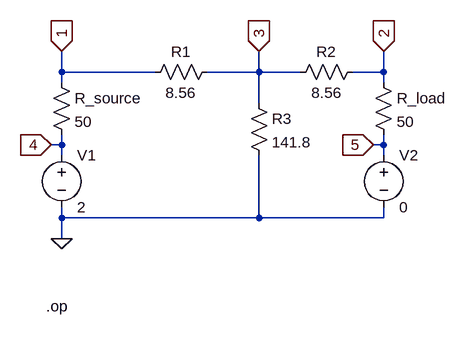
[diagram p0: schematic Two port circuit7.asc]
Two port circuit7.asc, the LTspice schematic file:
Version 4
SHEET 1 880 680
WIRE -304 -128 -304 -160
WIRE -160 -128 -304 -128
WIRE 0 -128 0 -160
WIRE 0 -128 -80 -128
WIRE 64 -128 0 -128
WIRE 192 -128 192 -160
WIRE 192 -128 144 -128
WIRE -304 -112 -304 -128
WIRE 192 -112 192 -128
WIRE 0 -80 0 -128
WIRE -304 -16 -304 -32
WIRE -304 -16 -320 -16
WIRE 192 -16 192 -32
WIRE 192 -16 176 -16
WIRE -304 0 -304 -16
WIRE 192 0 192 -16
WIRE -304 96 -304 80
WIRE 0 96 0 0
WIRE 0 96 -304 96
WIRE 192 96 192 80
WIRE 192 96 0 96
WIRE -304 128 -304 96
FLAG -304 128 0
FLAG 0 -160 3
IOPIN 0 -160 In
FLAG -304 -160 1
IOPIN -304 -160 In
FLAG 192 -160 2
IOPIN 192 -160 In
FLAG -320 -16 4
IOPIN -320 -16 In
FLAG 176 -16 5
IOPIN 176 -16 In
SYMBOL voltage -304 -16 R0
WINDOW 123 0 0 Left 2
WINDOW 39 0 0 Left 2
SYMATTR InstName V1
SYMATTR Value 2
SYMBOL res -176 -112 R270
WINDOW 0 32 56 VTop 2
WINDOW 3 0 56 VBottom 2
SYMATTR InstName R1
SYMATTR Value 8.56
SYMBOL res 48 -112 R270
WINDOW 0 32 56 VTop 2
WINDOW 3 0 56 VBottom 2
SYMATTR InstName R2
SYMATTR Value 8.56
SYMBOL res -16 -96 R0
SYMATTR InstName R3
SYMATTR Value 141.8
SYMBOL voltage 192 -16 R0
WINDOW 123 0 0 Left 2
WINDOW 39 0 0 Left 2
SYMATTR InstName V2
SYMATTR Value 0
SYMBOL res 176 -128 R0
SYMATTR InstName R_load
SYMATTR Value 50
SYMBOL res -320 -128 R0
SYMATTR InstName R_source
SYMATTR Value 50
TEXT -328 232 Left 2 !.op

The netlist it stands for:
* Two port circuit7.asc
V1 4 0 2
R1 1 3 8.56
R2 3 2 8.56
R3 3 0 141.8
V2 5 0 0
R_load 2 5 50
R_source 1 4 50
.op
.backanno
.end